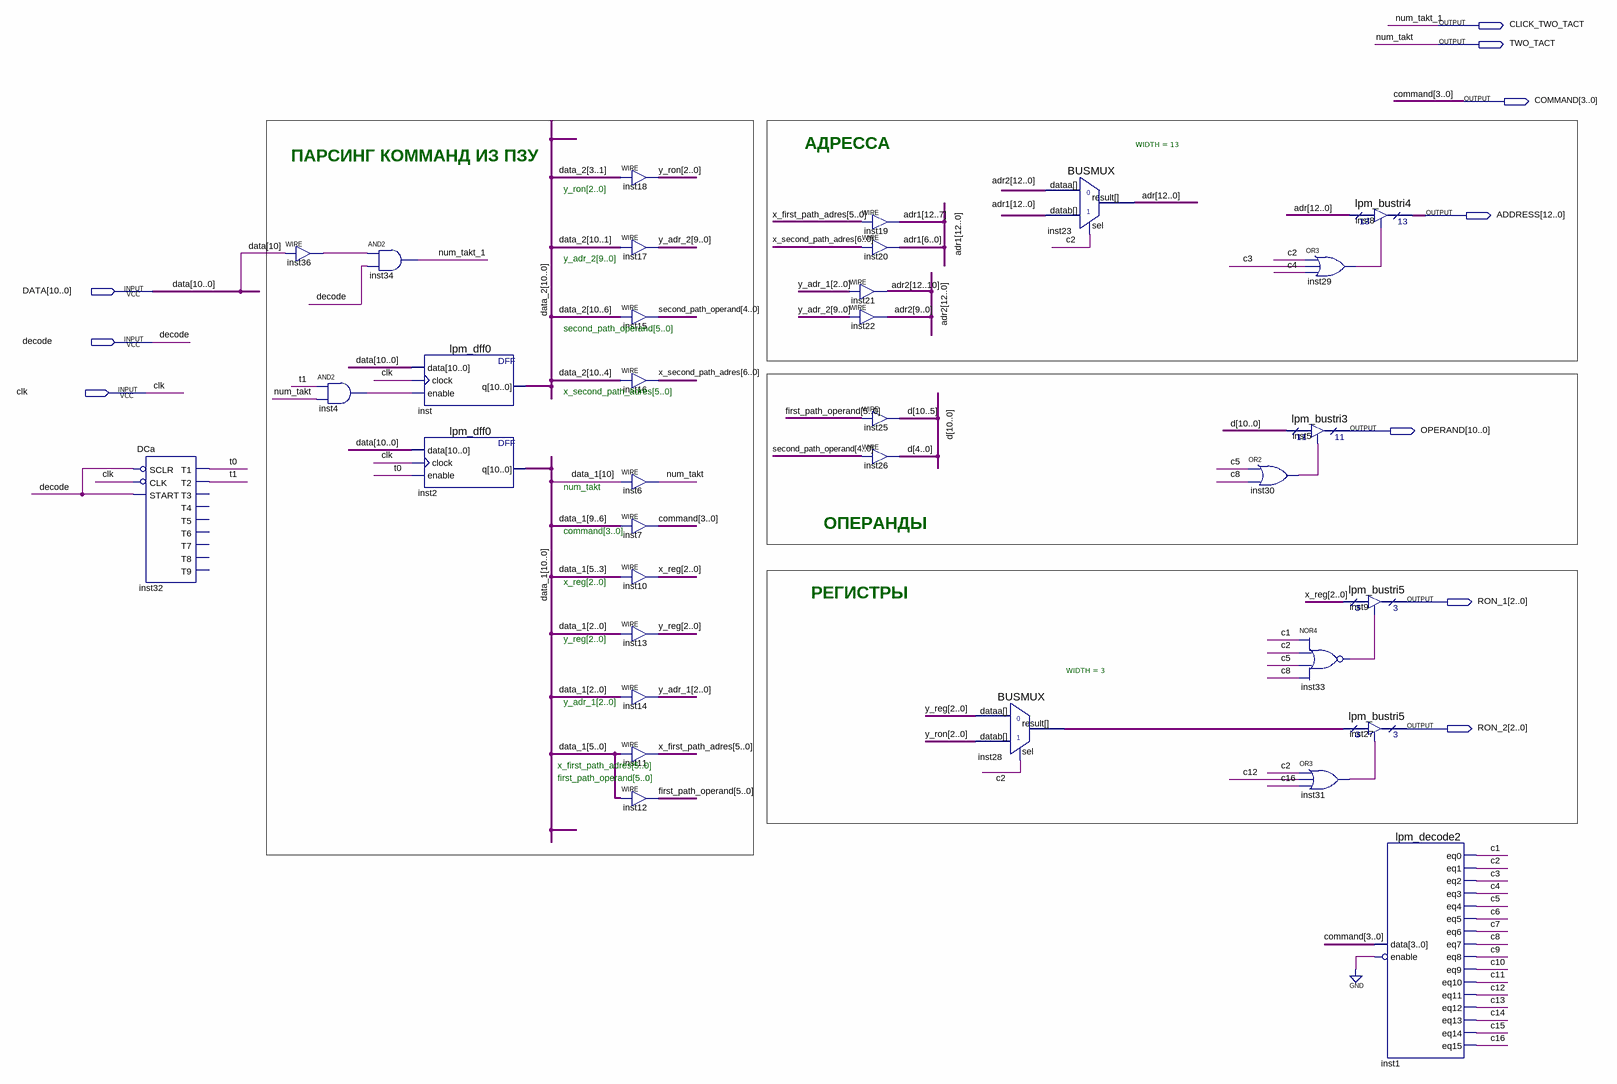
[diagram p0: schematic sheet]
// Quartus schematic DECODE_COMMAND.bdf as structural Verilog: 34 symbols, 10 pins
module DECODE_COMMAND (
  input  [10:0] DATA,
  input  decode,
  input  clk,
  output CLICK_TWO_TACT,
  output TWO_TACT,
  output [3:0] COMMAND,
  output [12:0] ADDRESS,
  output [10:0] OPERAND,
  output [2:0] RON_1,
  output [2:0] RON_2
);

  wire c1, c2, c3, c4, c5, c6, c7, c8, c9, c10, c11, c12, c13, c14, c15, c16, inst4_out, inst29_out,
       inst30_out, inst31_out, inst33_out, inst36_out, t0, t1;
  wire [2:0] inst28_result, x_reg, y_adr_1, y_reg, y_ron;
  wire [4:0] second_path_operand;
  wire [5:0] first_path_operand, x_first_path_adres;
  wire [6:0] x_second_path_adres;
  wire [9:0] y_adr_2;
  wire [10:0] d, data_1, data_2;
  wire [12:0] adr, adr1, adr2;

  DCa inst32 (.SCLR(~decode), .CLK(~clk), .START(decode), .T1(t0), .T2(t1));  // open: T3, T4, T5, T6, T7, T8, T9
  assign inst36_out = DATA[10];  // WIRE inst36
  and inst4 (inst4_out, t1, TWO_TACT);
  and inst34 (CLICK_TWO_TACT, inst36_out, decode);
  lpm_dff0 inst (.data(DATA), .clock(clk), .enable(inst4_out), .q(data_2));
  lpm_dff0 inst2 (.data(DATA), .clock(clk), .enable(t0), .q(data_1));
  assign y_ron = data_2[3:1];  // WIRE inst18
  assign y_adr_2 = data_2[10:1];  // WIRE inst17
  assign second_path_operand = data_2[10:6];  // WIRE inst15
  assign x_second_path_adres = data_2[10:4];  // WIRE inst16
  assign TWO_TACT = data_1[10];  // WIRE inst6
  assign COMMAND = data_1[9:6];  // WIRE inst7
  assign x_reg = data_1[5:3];  // WIRE inst10
  assign y_reg = data_1[2:0];  // WIRE inst13
  assign y_adr_1 = data_1[2:0];  // WIRE inst14
  assign x_first_path_adres = data_1[5:0];  // WIRE inst11
  assign first_path_operand = data_1[5:0];  // WIRE inst12
  assign adr1[12:7] = x_first_path_adres;  // WIRE inst19
  assign adr1[6:0] = x_second_path_adres;  // WIRE inst20
  assign adr2[12:10] = y_adr_1;  // WIRE inst21
  assign adr2[9:0] = y_adr_2;  // WIRE inst22
  assign d[10:5] = first_path_operand;  // WIRE inst25
  assign d[4:0] = second_path_operand;  // WIRE inst26
  BUSMUX #(.WIDTH(3)) inst28 (.datab(y_ron), .sel(c2), .dataa(y_reg), .result(inst28_result));
  BUSMUX #(.WIDTH(13)) inst23 (.datab(adr1), .sel(c2), .dataa(adr2), .result(adr));
  lpm_bustri3 inst5 (.enabledt(inst30_out), .data(d), .tridata(OPERAND));
  or inst30 (inst30_out, c5, c8);
  or inst29 (inst29_out, c2, c3, c4);
  lpm_bustri5 inst9 (.enabledt(inst33_out), .data(x_reg), .tridata(RON_1));
  nor inst33 (inst33_out, c1, c2, c5, c8);
  lpm_bustri5 inst27 (.enabledt(inst31_out), .data(inst28_result), .tridata(RON_2));
  or inst31 (inst31_out, c2, c12, c16);
  lpm_bustri4 inst8 (.enabledt(inst29_out), .data(adr), .tridata(ADDRESS));
  lpm_decode2 inst1 (
    .data(COMMAND), .enable(~1'b0), .eq0(c1), .eq1(c2), .eq2(c3), .eq3(c4), .eq4(c5), .eq5(c6), .eq6(c7),
    .eq7(c8), .eq8(c9), .eq9(c10), .eq10(c11), .eq11(c12), .eq12(c13), .eq13(c14), .eq14(c15), .eq15(c16));

  // Other names for the same wires on the sheet: num_takt = TWO_TACT; num_takt_1 = CLICK_TWO_TACT

  // Notes on the sheet:
  //   АДРЕССА
  //   ПАРСИНГ КОММАНД ИЗ ПЗУ
  //   y_ron[2..0]
  //   y_adr_2[9..0]
  //   second_path_operand[5..0]
  //   x_second_path_adres[5..0]
  //   num_takt
  //   ОПЕРАНДЫ
  //   command[3..0]
  //   x_reg[2..0]
  //   РЕГИСТРЫ
  //   y_reg[2..0]
  //   y_adr_1[2..0]
  //   x_first_path_adres[5..0]
  //   first_path_operand[5..0]
endmodule
